# EAGLE design MotorControl (EAGLE 9.2.2)
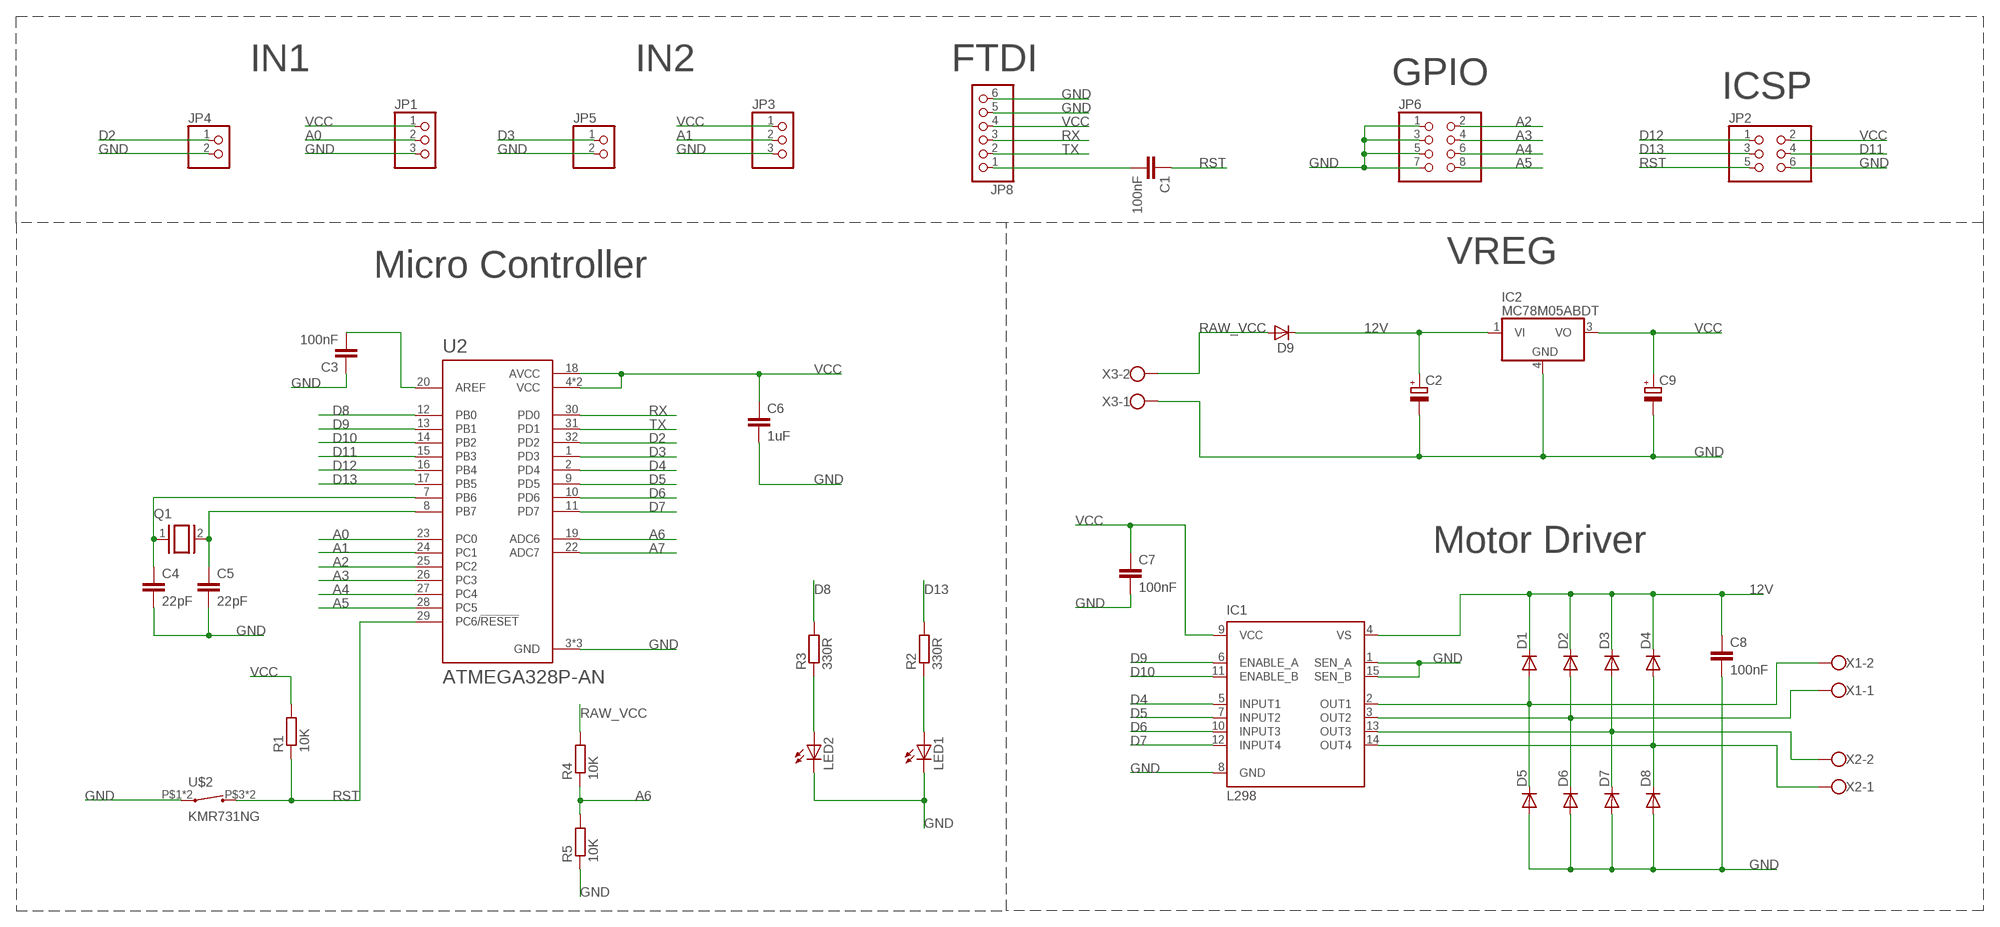
[diagram p0: schematic, sheet 1]

## Parts
C1  100nF  CC1206  [C1206]
C2  CPOL-EU140CLH-0810  [140CLH-0810]
C3  100nF  CC1206  [C1206]
C4  22pF  CC1206  [C1206]
C5  22pF  CC1206  [C1206]
C6  1uF  CC1206  [C1206]
C7  100nF  CC1206  [C1206]
C8  100nF  CC1206  [C1206]
C9  CPOL-EU140CLH-0810  [140CLH-0810]
D1  DIODE-DO214AC  [DO214AC]
D2  DIODE-DO214AC  [DO214AC]
D3  DIODE-DO214AC  [DO214AC]
D4  DIODE-DO214AC  [DO214AC]
D5  DIODE-DO214AC  [DO214AC]
D6  DIODE-DO214AC  [DO214AC]
D7  DIODE-DO214AC  [DO214AC]
D8  DIODE-DO214AC  [DO214AC]
D9  DIODE_E-SMC  [DIODE_SMC]
IC1  L298  [MULTIWATT-15]
IC2  MC78M05ABDT  [DPACK_3]
JP1  PINHD-1X3  [1X03]
JP2  PINHD-2X3  [2X03]
JP3  PINHD-1X3  [1X03]
JP4  PINHD-1X2  [1X02]
JP5  PINHD-1X2  [1X02]
JP6  PINHD-2X4  [2X04]
JP8  PINHD-1X6  [1X06]
LED1  LED_ESML0603  [LED_SML0603]
LED2  LED3MM  [LED3MM]
Q1  XTAL/S  [QS]
R1  10K  RR2012  [R2012]
R2  330R  RR2012  [R2012]
R3  330R  RR2012  [R2012]
R4  10K  RR2012  [R2012]
R5  10K  RR2012  [R2012]
U2  ATMEGA328P-AN  [QFP80P900X900X120-32N]
U$2  KMR731NG  [KMR731NG]
X1  W237-102  [W237-102]
X2  W237-102  [W237-102]
X3  W237-102  [W237-102]

## Nets
12V: C2.+ C8.1 D1.C D2.C D3.C D4.C D9.C(A) IC1.4(VS) IC2.1(VI)
A0: JP1.2 U2.23(PC0)
A1: JP3.2 U2.24(PC1)
A2: JP6.2 U2.25(PC2)
A3: JP6.4 U2.26(PC3)
A4: JP6.6 U2.27(PC4)
A5: JP6.8 U2.28(PC5)
A6: R4.1 R5.2 U2.19(ADC6)
A7: U2.22(ADC7)
D2: JP4.1 U2.32(PD2)
D3: JP5.1 U2.1(PD3)
D4: IC1.5(INPUT1) U2.2(PD4)
D5: IC1.7(INPUT2) U2.9(PD5)
D6: IC1.10(INPUT3) U2.10(PD6)
D7: IC1.12(INPUT4) U2.11(PD7)
D8: R3.2 U2.12(PB0)
D9: IC1.6(ENABLE_A) U2.13(PB1)
D10: IC1.11(ENABLE_B) U2.14(PB2)
D11: JP2.4 U2.15(PB3)
D12: JP2.1 U2.16(PB4)
D13: JP2.3 R2.2 U2.17(PB5)
GND: C2.- C3.1 C4.2 C5.2 C6.2 C7.2 C8.2 C9.- D5.A D6.A D7.A D8.A IC1.1(SEN_A) IC1.8(GND) IC1.15(SEN_B) IC2.4(GND) JP1.3 JP2.6 JP3.3 JP4.2 JP5.2 JP6.1 JP6.3 JP6.5 JP6.7 JP8.5 JP8.6 LED1.C LED2.K(C) R5.1 U2.3(GND) U2.5(GND) U2.21(GND) U$2.P$1 U$2.P$2 X3.1
N$1: D1.A D5.C IC1.2(OUT1) X1.2
N$2: C4.1 Q1.1 U2.7(PB6)
N$4: C3.2 U2.20(AREF)
N$5: C5.1 Q1.2 U2.8(PB7)
N$8: LED1.A R2.1
N$9: LED2.A R3.1
N$10: D2.A D6.C IC1.3(OUT2) X1.1
N$12: D3.A D7.C IC1.13(OUT3) X2.2
N$13: D4.A D8.C IC1.14(OUT4) X2.1
N$14: C1.2 JP8.1
RAW_VCC: D9.A(C) R4.2 X3.2
RST: C1.1 JP2.5 R1.1 U2.29(PC6/!RESET) U$2.P$3 U$2.P$4
RX: JP8.3 U2.30(PD0)
TX: JP8.2 U2.31(PD1)
VCC: C6.1 C7.1 C9.+ IC1.9(VCC) IC2.3(VO) JP1.1 JP2.2 JP3.1 JP8.4 R1.2 U2.4(VCC) U2.6(VCC) U2.18(AVCC)

## Notes on the sheet
- IN1 | IN2 | FTDI
- GPIO
- ICSP
- VREG
- Micro Controller
- Motor Driver

## Library data of the parts
C1 C3-C8 = eagle-ltspice:C: CAPACITOR, European symbol; SPICEMODEL: NONE; SPICEPREFIX: C
C2 C9 = rcl:CPOL-EU: POLARIZED CAPACITOR, European symbol; SPICEPREFIX: C
D1-D8 = diode:DIODE-: DIODE
D9 = eagle-ltspice:DIODE_E-: Schottky Diode; SPICEMODEL: diode; SPICEPREFIX: D
IC1 = st-microelectronics:L298: DUAL FULL-BRIDGE DRIVER; MPN: L298N; OC_FARNELL: 1589425; OC_NEWARK: 32M1527
IC2 = linear:MC78M: 500 mA Positive Voltage Regulators Source: Data sheet <http://www.onsemi.com/pub_link/Collateral/MC78M00-D.PDF>
JP1 JP3 = pinhead:PINHD-1X3: PIN HEADER
JP2 = pinhead:PINHD-2X3: PIN HEADER
JP4 JP5 = pinhead:PINHD-1X2: PIN HEADER
JP6 = pinhead:PINHD-2X4: PIN HEADER
JP8 = pinhead:PINHD-1X6: PIN HEADER
LED1 = eagle-ltspice:LED_E: LED Source: http://www.osram.convergy.de Source: www.luxeon.com Source: www.kingbright.com; SPICEMODEL: NONE; SPICEPREFIX: D; SPICETYPE: diode
LED2 = led:LED: LED OSRAM: - CHIPLED LG R971, LG N971, LY N971, LG Q971, LY Q971, LO R971, LY R971 LH N974, LH R974 LS Q976, LO Q976, LY Q976 LO Q996 - Hyper CHIPLED LW Q18S LB Q993, LB Q99A, LB R99A - SideLED LS A670, LO A670, LY A670, LG A670, LP A670 LB A673, LV A673, LT A673, LW A673 LH A674 LY A675 LS A676, LA A676, LO A676, LY A676, LW A676 LS A679, LY A679, LG A679 - Hyper Micro SIDELED® LS Y876, LA Y876, LO Y876, LY Y876 LT Y87S - SmartLED LW L88C, LW L88S LB L89C, LB L89S, LG L890 LS L89K, LO L89K, LY L89K LS L896, LA L896, LO L896, LY L896 - TOPLED LS T670, LO T670, LY T670, LG T670, LP T670 LSG T670, LSP T670, LSY T670, LOP T670, LYG T670 LG T671, LOG T671, LSG T671 LB T673, LV T673, LT T673, LW T673 LH T674 LS T676, LA T676, LO T676, LY T676, LB T676, LH T676, LSB T676, LW T676 LB T67C, LV T67C, LT T67C, LS T67K, LO T67K, LY T67K, LW E67C LS E67B, LA E67B, LO E67B, LY E67B, LB E67C, LV E67C, LT E67C LW T67C LS T679, LY T679, LG T679 LS T770, LO T770, LY T770, LG T770, LP T770 LB T773, LV T773, LT T773, LW T773 LH T774 LS E675, LA E675, LY E675, LS T675 LS T776, LA T776, LO T776, LY T776, LB T776 LHGB T686 LT T68C, LB T68C - Hyper Mini TOPLED® LB M676 - Mini TOPLED Santana® LG M470 LS M47K, LO M47K, LY M47K Source: http://www.osram.convergy.de LUXEON: - LUMILED® LXK2-PW12-R00, LXK2-PW12-S00, LXK2-PW14-U00, LXK2-PW14-V00 LXK2-PM12-R00, LXK2-PM12-S00, LXK2-PM14-U00 LXK2-PE12-Q00, LXK2-PE12-R00, LXK2-PE12-S00, LXK2-PE14-T00, LXK2-PE14-U00 LXK2-PB12-K00, LXK2-PB12-L00, LXK2-PB12-M00, LXK2-PB14-N00, LXK2-PB14-P00, LXK2-PB14-Q00 LXK2-PR12-L00, LXK2-PR12-M00, LXK2-PR14-Q00, LXK2-PR14-R00 LXK2-PD12-Q00, LXK2-PD12-R00, LXK2-PD12-S00 LXK2-PH12-R00, LXK2-PH12-S00 LXK2-PL12-P00, LXK2-PL12-Q00, LXK2-PL12-R00 Source: www.luxeon.com KINGBRIGHT: KA-3528ASYC Source: www.kingbright.com
Q1 = special:XTAL/S: CRYSTAL
R1-R5 = eagle-ltspice:R: RESISTOR, European symbol; SPICEMODEL: NONE; SPICEPREFIX: R
U2 = ATMEGA328P-AN:ATMEGA328P-AN: ATmega Series 20 MHz 32 KB Flash 2 KB SRAM 8-Bit Microcontroller - TQFP-32; AVAILABILITY: Unavailable; DESCRIPTION: MCU 8-bit ATmega AVR RISC 32KB Flash 2.5V/3.3V/5V 32-Pin TQFP Tray; MF: Microchip; MP: ATMEGA328P-AN; PACKAGE: TQFP-32 Microchip; PRICE: None
U$2 = button:KMR731NG
X1-X3 = con-wago-500:W237-102: WAGO SCREW CLAMP; MPN: 237-102; OC_FARNELL: unknown; OC_NEWARK: 70K9898

## Board
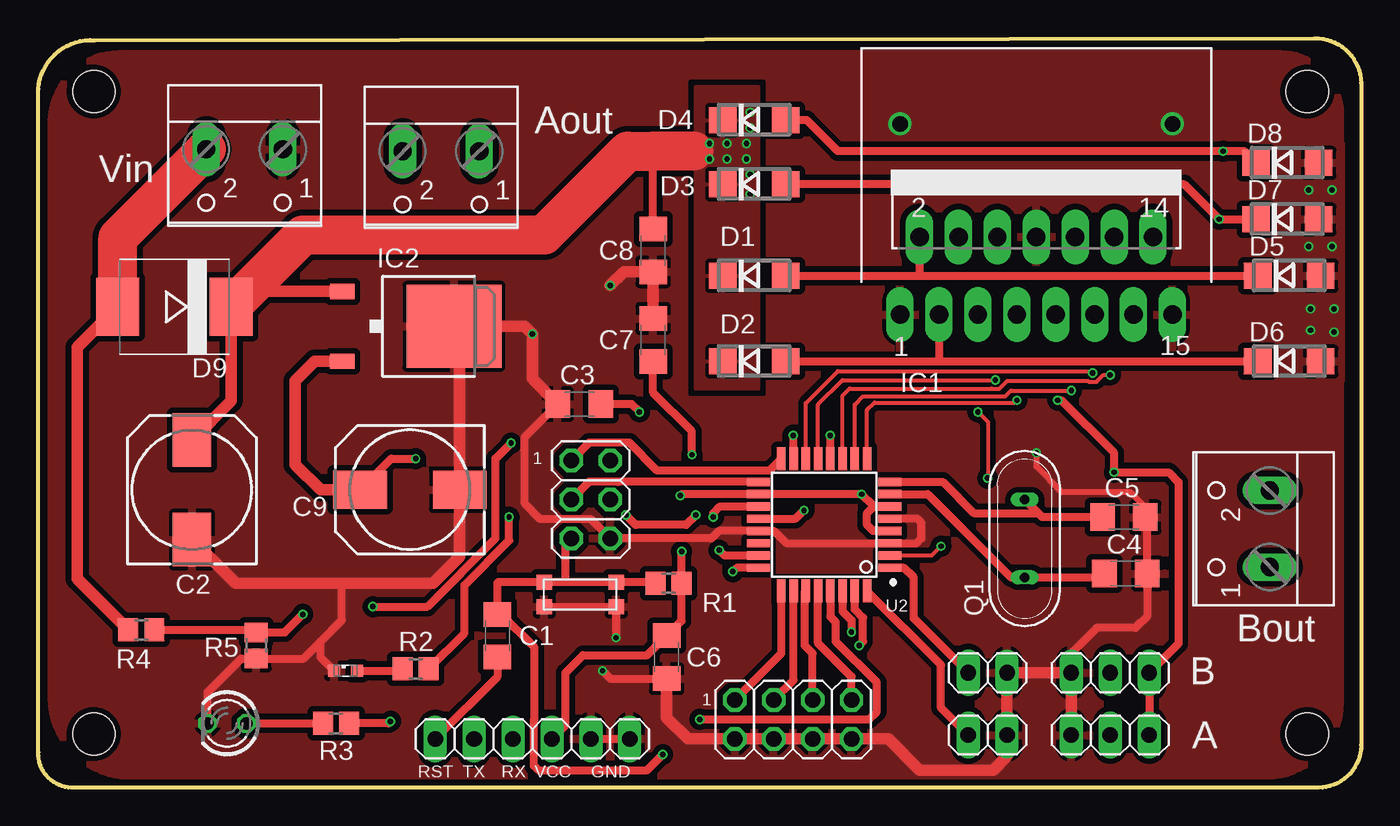
[diagram p1: board, top side]
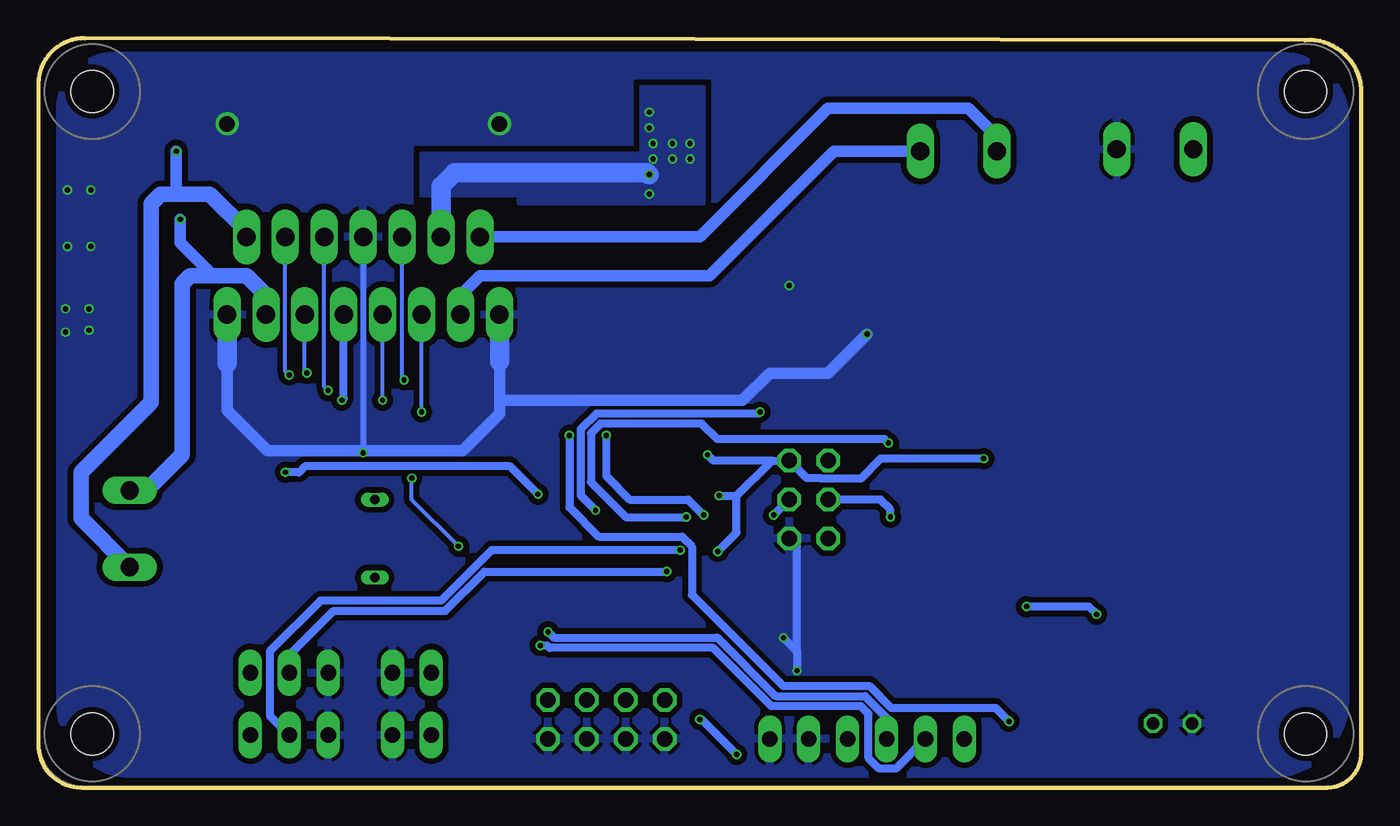
[diagram p2: board, bottom side, seen from below]

Size 86.36 x 48.89 mm. Coordinates in mm from the lower left corner, seen from the top.
Outline: 0,45.59 arc-90 3.68,48.77 83.31,48.89 arc-90 86.36,45.97 86.36,2.79 arc-90 83.57,0 2.16,0 arc-90 0,2.29 0,45.59
Copper layers (1*16): Top 0.035559375mm / dielectric 1.6mm / Bottom 0.035559375mm
Design rules "oshpark-2layer": minimum track width 6mil, minimum drill 10mil, track to track 6mil, track to pad 6mil, pad to pad 6mil, via to via 6mil, smd to smd 6mil, copper to edge 15mil, drill to drill 6mil, minimum pad ring 5mil, minimum via ring 5mil, stop-mask expansion 2.5mil, vias tented up to drill 0mil, thermal gap 10mil
Holes 2.75 mm at 3.63,3.5 3.63,45.42 82.84,3.5 82.84,45.42

### Footprints (pad centres in the part's own frame; a part is rotated, then mirrored left to right if it is on the bottom)
C1206 = smd 1.6 x 1.8: 1 -1.4,0; 2 1.4,0
140CLH-0810 = smd 3.5 x 2.5: + 3.25,0; - -3.25,0
DO214AC = smd 1.8 x 1.7: A 2.05,0; C -2.05,0
DIODE_SMC = smd 2.8 x 3.8: A 3.7,0; C -3.7,0
MULTIWATT-15 = drill 1.2 long: 1 -8.89,-7.62; 2 -7.62,-2.54; 3 -6.35,-7.62; 4 -5.08,-2.54; 5 -3.81,-7.62; 6 -2.54,-2.54; 7 -1.27,-7.62; 8 0,-2.54; 9 1.27,-7.62; 10 2.54,-2.54; 11 3.81,-7.62; 12 5.08,-2.54; 13 6.35,-7.62; 14 7.62,-2.54; 15 8.89,-7.62
DPACK_3 = smd 1 x 1.6: 1 -2.28,-4.8; 3 2.28,-4.8 | smd 5.4 x 6.2: 4 0,2.5
1X03 = drill 1.016 long: 1 -2.54,0; 2 0,0; 3 2.54,0
2X03 = drill 1.016 octagon: 1 -2.54,-1.27; 2 -2.54,1.27; 3 0,-1.27; 4 0,1.27; 5 2.54,-1.27; 6 2.54,1.27
1X02 = drill 1.016 long: 1 -1.27,0; 2 1.27,0
2X04 = drill 1.016 octagon: 1 -3.81,-1.27; 2 -3.81,1.27; 3 -1.27,-1.27; 4 -1.27,1.27; 5 1.27,-1.27; 6 1.27,1.27; 7 3.81,-1.27; 8 3.81,1.27
1X06 = drill 1.016 long: 1 -6.35,0; 2 -3.81,0; 3 -1.27,0; 4 1.27,0; 5 3.81,0; 6 6.35,0
LED_SML0603 = smd 0.8 x 0.8: A 0.75,0; C -0.75,0
LED3MM = drill 0.813 octagon: A -1.27,0; K 1.27,0
QS = drill 0.61 long: 1 -2.54,0; 2 2.54,0
R2012 = smd 1.3 x 1.5: 1 -0.85,0; 2 0.85,0
QFP80P900X900X120-32N = smd 1.5 x 0.55: 1 -4.3,2.8; 2 -4.3,2; 3 -4.3,1.2; 4 -4.3,0.4; 5 -4.3,-0.4; 6 -4.3,-1.2; 7 -4.3,-2; 8 -4.3,-2.8; 17 4.3,-2.8; 18 4.3,-2; 19 4.3,-1.2; 20 4.3,-0.4; 21 4.3,0.4; 22 4.3,1.2; 23 4.3,2; 24 4.3,2.8 | smd 0.55 x 1.5: 9 -2.8,-4.3; 10 -2,-4.3; 11 -1.2,-4.3; 12 -0.4,-4.3; 13 0.4,-4.3; 14 1.2,-4.3; 15 2,-4.3; 16 2.8,-4.3; 25 2.8,4.3; 26 2,4.3; 27 1.2,4.3; 28 0.4,4.3; 29 -0.4,4.3; 30 -1.2,4.3; 31 -2,4.3; 32 -2.8,4.3
KMR731NG = smd 1 x 1: P$1 0.5,-0.5; P$2 5.2,-0.5; P$3 5.2,-2.1; P$4 0.5,-2.1
W237-102 = drill 1.194 long: 1 -2.5,-1.27; 2 2.5,-1.27

### Placement (x,y rotation side)
C1  29.97,9.91 270 top
C2  10.03,19.43 90 top
C3  35.31,25.02 0 top
C4  70.99,13.97 0 top
C5  70.87,17.65 0 top
C6  41.02,8.51 270 top
C7  40.13,29.21 90 top
C8  40.13,35.05 270 top
C9  24.26,19.43 180 top
D1  46.74,33.4 0 top
D2  46.74,27.81 0 top
D3  46.74,39.37 0 top
D4  46.74,43.56 0 top
D5  81.66,33.4 0 top
D6  81.66,27.81 0 top
D7  81.53,37.08 0 top
D8  81.53,40.77 0 top
D9  8.89,31.37 180 top
IC1  65.15,38.48 0 top
IC2  24.64,30.1 270 top
JP1  69.98,3.43 180 top
JP2  36.07,18.8 270 top
JP3  69.98,7.49 180 top
JP4  61.98,3.43 0 top
JP5  61.98,7.49 0 top
JP6  49.28,4.45 0 top
JP8  32.26,3.18 0 top
LED1  20.07,7.62 0 top
LED2  12.32,4.19 180 top
Q1  64.39,16.26 90 top
R1  41.15,13.34 0 top
R2  24.64,7.75 0 top
R3  19.43,4.19 0 top
R4  6.73,10.29 180 top
R5  14.22,9.27 90 top
U2  51.31,17.14 180 top
U$2  38.23,11.3 180 top
X1  26.29,40.26 180 top
X2  79.12,16.89 90 top
X3  13.46,40.39 180 top

### Tracks (layer width: path | path; a pad name or v marks a point on that pad's centre or on a via)
12V  (via drill 0.35)
  Top 0.508: C8.1 40.13,41.53 | v43.82,41.02 43.31,41.53 42.8,41.53
  Top 0.762: C2.+ 12.59,25.24 D9.C 13.6,32.38 IC2.1
  Top 2.54: D9.C 17.29,36.07 33.02,36.07 38.48,41.53 40.13,41.53 42.8,41.53
  Bottom 1.27: IC1.4 60.07,39.24 59.18,40.13 46.61,40.13 v46.48,40.01
  other vias: 43.82,42.04 44.96,42.04 46.23,42.04 44.96,41.02 46.23,41.02 46.48,44.07 46.48,43.05 46.48,38.73
  pour Bottom: 54.99,38.61 61.34,38.61 61.34,41.4 46.99,41.4 46.99,45.72 42.93,45.72 42.93,38.1 54.99,38.1
  pour Top: 42.93,45.72 46.99,45.72 46.99,26.03 42.93,26.03
A0  (via drill 0.35)
  Top 0.508: v44.45,15.49 44.8,15.14 U2.23
  Bottom 0.508: JP1.2 71.25,4.7 71.25,8.89 67.94,12.19 60.07,12.19 56.77,15.49 v44.45,15.49
A1  (via drill 0.35)
  Top 0.508: U2.24 45.59,14.34 v45.34,14.1
  Bottom 0.508: JP3.2 69.98,8.64 67.08,11.53 59.8,11.53 57.23,14.1 v45.34,14.1
A2
  Top 0.508: JP6.2 48.51,8.76 U2.25
A3
  Top 0.508: JP6.4 49.31,7.02 U2.26
A4
  Top 0.508: JP6.6 50.55,8.76 50.04,9.27 50.04,12.77 U2.27
A5
  Top 0.508: U2.28 50.91,9.42 53.09,7.24 JP6.8
A6  (via drill 0.35)
  Top 0.508: v21.84,11.81 25.4,11.81 29.84,16.26 29.84,21.46 v30.86,22.48 | v44.07,17.65 44.07,17.91 44.51,18.34 U2.19 | R4.1 14.06,10.29 R5.2 16.09,10.12 v17.27,11.3
  Bottom 0.508: v30.86,22.48 31.12,22.73 42.04,22.73 43.05,23.75 49.66,23.75 50.29,23.11 50.29,19.94 48.01,17.65 v44.07,17.65 | v17.27,11.3 17.78,11.81 v21.84,11.81
D2
  Top 0.508: JP4.1 58.93,5.21 58.93,8 54.11,12.82 U2.32
D3
  Top 0.508: JP5.1 57.15,11.05 57.15,13.72 56.52,14.34 U2.1
D4  (via drill 0.35)
  Top 0.254: U2.2 58.32,15.14 v58.93,15.75 | v61.34,24.51 61.98,23.88 v61.98,20.19
  Bottom 0.254: v61.34,24.51 IC1.5 | v61.98,20.19 61.98,18.8 v58.93,15.75
D5  (via drill 0.35)
  Top 0.254: v63.88,25.27 63.73,25.12 54.59,25.12 54.11,24.64 U2.9
  Bottom 0.254: v63.88,25.27 IC1.7
D6  (via drill 0.35)
  Top 0.254: U2.10 53.31,24.99 53.85,25.53 63.12,25.53 63.5,25.91 v67.44,25.91
  Bottom 0.254: v67.44,25.91 67.69,26.16 IC1.10
D7  (via drill 0.35)
  Top 0.254: U2.11 52.51,25.58 52.96,26.03 62.22,26.03 62.24,26.02 62.73,26.02 63.25,26.54 68.52,26.54 68.59,26.47 69.07,26.47 69.53,26.92 v69.98,26.92
  Bottom 0.254: v69.98,26.92 70.23,27.18 IC1.12
D8  (via drill 0.35)
  Top 0.508: U2.12 51.71,22.97 v51.69,22.99 | v22.99,4.32 22.86,4.19 R3.2
  Bottom 0.508: v51.69,22.99 51.69,18.29 49.78,16.38 44.34,16.38 43.69,15.73 43.69,12.57 37.74,6.63 32.11,6.63 30.69,5.21 23.88,5.21 v22.99,4.32
D9  (via drill 0.35)
  Top 0.254: U2.13 50.91,25 52.51,26.6 v62.48,26.6
  Bottom 0.254: v62.48,26.6 62.61,26.72 IC1.6
D10  (via drill 0.35)
  Top 0.254: U2.14 50.11,25.09 52.2,27.18 68.71,27.18 v68.83,27.05
  Bottom 0.254: v68.83,27.05 68.96,27.18 IC1.11
D11  (via drill 0.35)
  Top 0.508: v49.28,22.99 49.28,21.48 U2.15 | v38.35,17.78 38.99,17.14 42.29,17.14 v42.93,17.78
  Bottom 0.508: v49.28,22.99 49.28,20.32 47.75,18.8 43.94,18.8 v42.93,17.78 | v38.35,17.78 JP2.4
D12
  Top 0.508: U2.16 47.75,20.68 40.4,20.68 38.58,22.5 35.97,22.5 JP2.1
D13  (via drill 0.35)
  Top 0.508: U2.17 37.84,19.95 37.82,19.96 35.97,19.96 JP2.3 | R2.2 27.81,10.07 27.81,13.21 30.73,16.13 v30.73,17.65
  Bottom 0.508: v30.73,17.65 30.73,18.16 31.37,18.8 JP2.3
GND  (via drill 0.35, 1)
  Top 0.381: v65.15,21.84 65.15,20.95 66.8,19.3 71.25,19.3 72.39,18.16 72.39,17.53
  Top 0.508: U2.5 57.38,17.55 57.66,17.27 57.66,16.26 57.35,15.95 U2.3 48.82,15.95 48.02,16.74 U2.21 44.43,16.74 43.94,16.26 JP2.6 36.07,17.53 32.77,17.53 31.75,18.54 31.75,22.86 C3.1 | LED2.K 11.05,6.22 13.25,8.42 R5.1 17.31,8.42 18.41,9.52 | C5.2 72.39,17.53 C4.2 72.39,11.18 71.63,10.41 69.09,10.41 67.44,8.76 JP3.3 | U$2.P$2 U$2.P$1 v37.73,9.79 v37.72,9.78 | v36.83,7.62 37.34,7.11 C6.2 | JP8.5 JP8.6 | 19.81,13.34 19.81,10.92 18.41,9.52 | LED1.C 18.41,8.52 18.41,9.52
  Top 0.762: C2.- 12.88,13.34 19.81,13.34 25.78,13.34 27.51,15.06 C9.- 27.51,29.73 IC2.4 31.75,30.1 v32.26,29.59 32.26,26.67 C3.1 | JP1.3 JP3.3 JP5.2 JP4.2 63.25,2.03 62.36,1.14 57.53,1.14 55.5,3.18 JP6.7 JP6.5 JP6.3 JP6.1 42.42,3.18 41.02,4.57 C6.2 | C7.2 C8.2 38.22,33.65 v37.34,32.77
  Bottom 0.381: IC1.8 v65.15,21.84
  Bottom 0.508: v37.72,9.78 36.83,8.89 | 36.83,8.89 v36.83,7.62 | 36.83,8.89 36.83,15.75 JP2.6
  Bottom 0.762: 74.04,27.69 74.04,24.64 71.37,21.97 58.67,21.97 56.26,24.38 56.26,25.27 | 56.26,27.81 56.26,25.27 | 56.26,25.27 40.39,25.27 38.61,27.05 34.8,27.05 v32.26,29.59
  Bottom 1.27: IC1.15 74.04,27.69 | IC1.1 56.26,27.81
  other vias: 82.93,38.99 84.46,38.99 82.93,35.31 84.46,35.31 83.06,31.24 84.58,31.24 83.06,29.84 84.58,29.72 56.26,43.31 74.04,43.31
  pour Bottom (isolate 0.381, rank 6): 1.02,43.56 arc-90 5.21,47.75 81.41,47.75 arc-90 84.96,44.2 84.96,5.59 arc-90 80.26,0.89 5.84,0.89 arc-90 1.02,5.71
  pour Top: 82.3,42.04 85.22,42.04 85.22,26.54 82.17,26.54 82.17,42.04
  pour Top (isolate 0.381, rank 6): 0.89,43.43 arc-90 5.33,47.88 81.03,47.88 arc-90 84.96,43.94 84.96,5.59 arc-90 80.14,0.76 5.97,0.76 arc-90 0.89,5.84
N$1
  Top 0.508: D1.A 57.53,33.4 | 57.53,33.4 D5.C | IC1.2 57.53,33.4
  Bottom 0.762: IC1.2 43.18,35.94 34.8,44.32 25.65,44.32 23.79,42.46 X1.2
N$2
  Top 0.508: U2.7 58.07,19.14 63.5,13.72 Q1.1 69.34,13.72 C4.1
N$4  (via drill 0.35)
  Top 0.508: U2.20 49.44,17.55 v49.98,18.09 | v39.24,24.51 38.74,25.02 C3.2
  Bottom 0.508: v49.98,18.09 50.95,19.06 50.95,23.39 49.93,24.41 39.35,24.41 v39.24,24.51
N$5
  Top 0.508: U2.8 59.05,19.95 61.09,17.91 65.28,17.91 | C5.1 65.53,17.65 65.28,17.91 | 65.28,17.91 Q1.2
N$8
  Top 0.508: LED1.A 23.66,7.62 R2.1
N$9
  Top 0.508: LED2.A R3.1
N$10
  Top 0.508: D2.A 58.8,27.81 | 58.8,27.81 D6.C | IC1.3 58.8,27.81
  Bottom 0.762: IC1.3 58.8,32.13 57.53,33.4 42.54,33.4 34.42,41.53 X1.1
N$12  (via drill 0.35)
  Top 0.508: D3.A 74.8,39.37 v77.09,37.08 D7.C
  Bottom 0.762: 72.77,33.4 74.93,33.4 | 74.93,33.4 77.09,35.56 v77.09,37.08 | 74.93,33.4 76.45,33.4
  Bottom 1.016: IC1.13 71.5,32.13 72.77,33.4 76.45,33.4 76.96,32.89 76.96,21.72 79.29,19.39 X2.2
N$13  (via drill 0.35)
  Top 0.508: D8.C 78.72,41.53 v77.34,41.53 52.2,41.53 50.16,43.56 D4.A
  Bottom 0.762: v77.34,41.53 77.34,38.73
  Bottom 1.016: X2.1 83.57,17.57 83.57,20.57 78.99,25.15 78.99,38.1 78.36,38.73 77.34,38.73 75.18,38.73 72.77,36.32 IC1.14
N$14
  Top 0.508: C1.2 29.97,7.24 JP8.1
RAW_VCC
  Top 0.762: R4.2 2.54,13.63 2.54,28.72 D9.A
  Top 2.54: D9.A 5.19,35.88 X3.2
RST  (via drill 0.35)
  Top 0.508: U2.29 51.71,11.16 52.07,10.79 52.07,9.52 54.74,6.86 54.74,4.95 54.23,4.45 v43.18,4.45 | R1.1 40.23,13.4 U$2.P$4 34.42,13.4 | 34.42,13.4 U$2.P$3 30.04,13.4 29.97,13.34 C1.1 30.22,11.31 32.38,9.14 32.38,4.45 32.36,4.42 32.36,1.42 32.64,1.14 39.75,1.14 v40.77,2.16 | 34.42,13.4 34.42,15.88 JP2.5
  Bottom 0.508: v40.77,2.16 43.05,4.45 v43.18,4.45
RX  (via drill 0.35)
  Top 0.508: U2.30 52.51,11.5 53.09,10.92 v53.09,10.16
  Bottom 0.508: v53.09,10.16 52.71,9.78 42.04,9.78 38.23,5.97 32.38,5.97 30.99,4.57 JP8.3
TX  (via drill 0.35)
  Top 0.508: v53.59,9.27 53.85,9.52 53.85,11.09 53.31,11.63 U2.31
  Bottom 0.508: JP8.2 30.38,1.25 31.47,1.25 32.16,1.93 32.16,4.81 32.66,5.31 38.5,5.31 42.31,9.12 52.98,9.12 53.13,9.27 v53.59,9.27
VCC  (via drill 0.35)
  Top 0.508: U2.4 54.5,16.74 54.1,17.14 54.1,17.91 54.54,18.34 | 54.54,18.34 U2.6 | 54.54,18.34 v53.74,19.14 U2.18 42.01,19.14 v41.91,19.05 | C9.+ 23.04,21.46 v24.64,21.46 | JP8.4 34.42,4.06 34.42,7.49 35.56,8.64 39.75,8.64 C6.1 42,10.89 R1.2 v42,15.41 | v42.67,21.72 42.67,23.24 40.13,25.78 C7.1 | v66.55,25.27 66.8,25.27 70.23,21.84 v70.23,20.57 73.79,20.57 74.42,19.94 74.42,9.4 JP3.1 JP1.1
  Top 0.762: IC2.3 18.04,27.82 16.76,26.54 16.76,21.08 18.41,19.43 C9.+
  Bottom 0.508: v53.74,19.14 55.55,20.95 68.96,20.95 69.34,20.57 v70.23,20.57 | 38.48,21.34 JP2.2 36.2,20.19 35.31,20.19 35.28,20.17 32.66,20.17 31.37,21.46 v24.64,21.46 | v41.91,19.05 40.77,19.05 | 40.77,19.05 38.48,21.34 | 40.77,19.05 40.77,16.64 v42,15.41 | 38.48,21.34 42.29,21.34 v42.67,21.72 | v66.55,25.27 66.42,25.4 IC1.9

### Text on the board
tPlace: Aout | Vin | Bout | B | A | RST | TX | RX | VCC | GND
tNames: 1 | 1